# Altium schematic sheet TP3_EJ3.SchDoc
size A
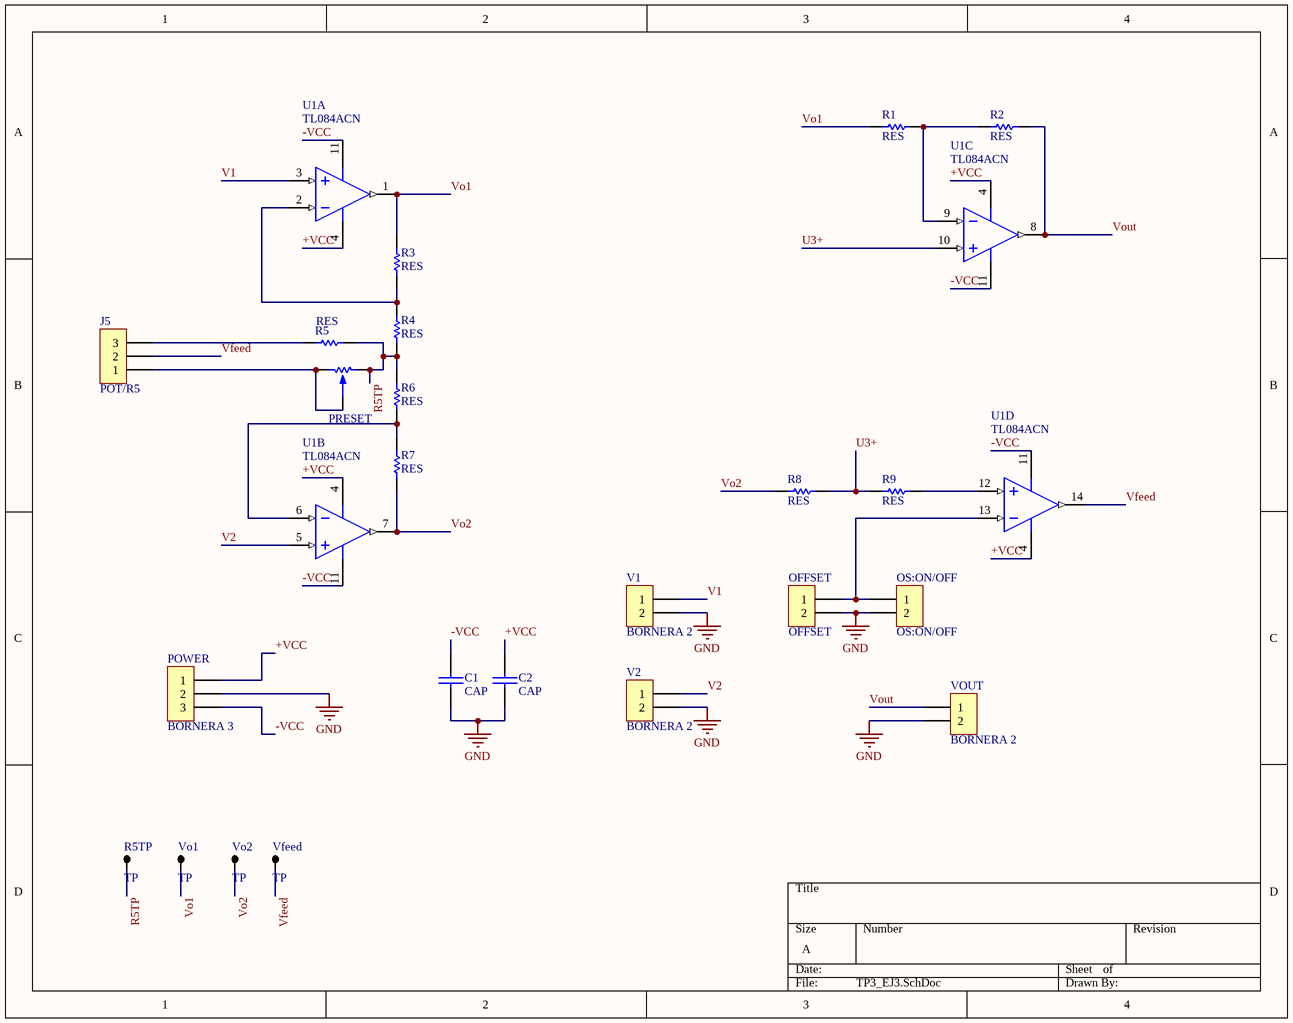
[diagram p0: TP3_EJ3.SchDoc]

## Parts
?  PRESET  [PRESET V]
C1  CAP  [CAP200]
C2  CAP  [CAP200]
J5  POT/R5  [SIP3]
OFFSET  OFFSET  [BORNERA2]
OS:ON/OFF  OS:ON/OFF  [SIP2]
POWER  BORNERA 3  [BORNERA3]
R1  RES  [0805]
R2  RES  [0805]
R3  RES  [0805]
R4  RES  [0805]
R5  RES  [0805]
R5TP  TP  [TPTH]
R6  RES  [0805]
R7  RES  [0805]
R8  RES  [RES300]
R9  RES  [RES300]
U1  TL084ACN  [TI-N14]  (parts A,B,C,D of 4)
V1  BORNERA 2  [BORNERA2]
V2  BORNERA 2  [BORNERA2]
Vfeed  TP  [TPTH]
Vo1  TP  [TPTH]
Vo2  TP  [TPTH]
VOUT  BORNERA 2  [BORNERA2]

## Nets
GND: C1.2 C2.2 OFFSET.2 OS:ON/OFF.2 POWER.2 V1.2 V2.2 VOUT.2
+VCC: C2.1 POWER.1 U1.4(VCC+)
-VCC: C1.1 POWER.3 U1.11(VCC-)
R5TP: ?.3 R4.1 R5.2 R5TP.1 R6.2
U3+: R8.2 R9.1 U1.10(IN3+)
V1: U1.3(IN1+) V1.1
V2: U1.5(IN2+) V2.1
Vfeed: J5.2 U1.14(OUT4) Vfeed.1
Vo1: R1.1 R3.2 U1.1(OUT1) Vo1.1
Vo2: R7.1 R8.1 U1.7(OUT2) Vo2.1
Vout: R2.2 U1.8(OUT3) VOUT.1
Net?_1: ?.1 ?.2 J5.1
NetJ5_3: J5.3 R5.1
NetOFFSET_1: OFFSET.1 OS:ON/OFF.1 U1.13(IN4-)
NetR1_2: R1.2 R2.1 U1.9(IN3-)
NetR3_1: R3.1 R4.2 U1.2(IN1-)
NetR6_1: R6.1 R7.2 U1.6(IN2-)
NetR9_2: R9.2 U1.12(IN4+)

## Library data of the parts
J5 = CON3
OFFSET = BORNERA 2
OS:ON/OFF = CON2
U1 = TL084ACN: JFET-Input Operational Amplifier, 7 to 36 V, 0 to 70 degC, 14-pin DIP (N14), Pb-Free (RoHS); Manufacturer: Texas Instruments; CMRR(Min)(dB): 75; GBW(Typ)(MHz): 3; IIB(Max)(pA): 200; Iq per channel(Max)(mA): 2.8; Number of Channels: 4; Offset Drift(Typ)(uV/C): 18; Rating: Catalog; Slew Rate(Typ)(V/us): 13; Sub Family: General Purpose Amplifier, High Supply Voltage Amplifier (>=30V); Total Supply Voltage(Max)(+5V is 5, +/-5V is 10): 36; Total Supply Voltage(Min)(+5V is 5, +/-5V is 10): 7; Vio (25C)(Max)(mV): 6; DatasheetVersion: SLOS081G; PackageVersion: 4040049/E, 12/2002; PackageReference: N14; PackageDescription: 14-Pin Plastic In-Line, Body 19.305 x 6.35 mm, Pitch 2.54 mm; Supplier 1: Digi-Key; Supplier Part Number 1: 296-1782-5-ND; Supplier 2: Farnell; Supplier Part Number 2: 1106129; Supplier 3: Newark; Supplier Part Number 3: 08F9361; Supplier 4: Mouser; Supplier Part Number 4: 595-TL084ACN; Eco-Plan: Pb-Free (RoHS); Vn at 1kHz(Typ)(nV/rtHz): 18; Mounting Technology: Through Hole; Code_JEDEC: MS-001; PartNumber: TL084ACN; ComponentLink1Description: Manufacturer URL; ComponentLink1URL: http://www.ti.com/; ComponentLink2Description: Datasheet; ComponentLink2URL: http://www.ti.com/lit/ds/symlink/tl084a.pdf; ComponentLink3Description: Package Specification; ComponentLink3URL: http://www.ti.com/lit/ml/mpdi002c/mpdi002c.pdf